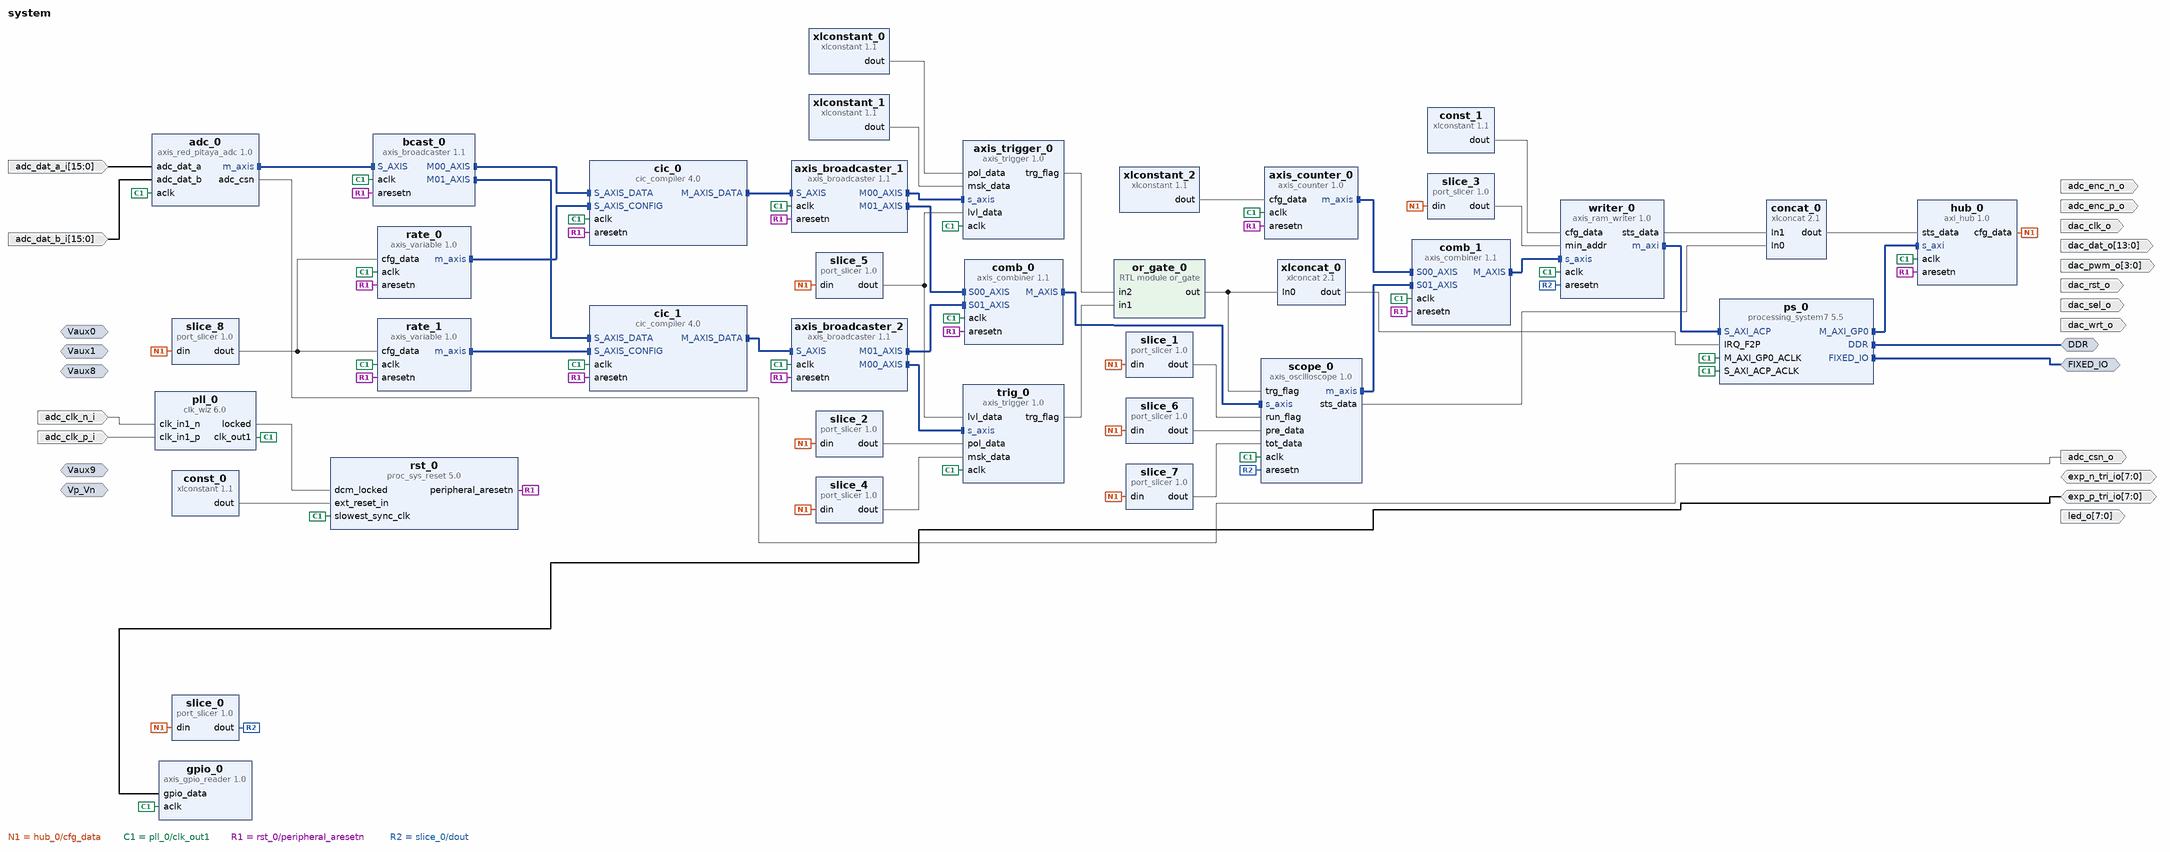
[diagram p0: block diagram of the top level]
# Vivado block design system, xc7z010clg400-1, Vivado 2024.1
create_bd_design system

create_bd_intf_port -mode Slave -vlnv xilinx.com:interface:diff_analog_io_rtl:1.0 Vp_Vn
create_bd_intf_port -mode Slave -vlnv xilinx.com:interface:diff_analog_io_rtl:1.0 Vaux0
create_bd_intf_port -mode Slave -vlnv xilinx.com:interface:diff_analog_io_rtl:1.0 Vaux1
create_bd_intf_port -mode Slave -vlnv xilinx.com:interface:diff_analog_io_rtl:1.0 Vaux9
create_bd_intf_port -mode Slave -vlnv xilinx.com:interface:diff_analog_io_rtl:1.0 Vaux8
create_bd_intf_port -mode Master -vlnv xilinx.com:interface:ddrx_rtl:1.0 DDR
create_bd_intf_port -mode Master -vlnv xilinx.com:display_processing_system7:fixedio_rtl:1.0 FIXED_IO
create_bd_port -dir I -from 15 -to 0 adc_dat_a_i
create_bd_port -dir I -from 15 -to 0 adc_dat_b_i
create_bd_port -dir I adc_clk_p_i
create_bd_port -dir I adc_clk_n_i
create_bd_port -dir O adc_enc_p_o
create_bd_port -dir O adc_enc_n_o
create_bd_port -dir O adc_csn_o
create_bd_port -dir O -from 13 -to 0 dac_dat_o
create_bd_port -dir O dac_clk_o
create_bd_port -dir O dac_rst_o
create_bd_port -dir O dac_sel_o
create_bd_port -dir O dac_wrt_o
create_bd_port -dir O -from 3 -to 0 dac_pwm_o
create_bd_port -dir IO -from 7 -to 0 exp_p_tri_io
create_bd_port -dir IO -from 7 -to 0 exp_n_tri_io
create_bd_port -dir O -from 7 -to 0 led_o

create_bd_cell -type ip -vlnv xilinx.com:ip:clk_wiz:6.0 pll_0
set_property -dict [list \
  CONFIG.CLKOUT1_REQUESTED_OUT_FREQ 125.0 \
  CONFIG.CLKOUT1_USED true \
  CONFIG.PRIMITIVE PLL \
  CONFIG.PRIM_IN_FREQ 125.0 \
  CONFIG.PRIM_SOURCE Differential_clock_capable_pin \
  CONFIG.USE_RESET false \
] [get_bd_cells pll_0]
create_bd_cell -type ip -vlnv xilinx.com:ip:processing_system7:5.5 ps_0
set_property -dict [list \
  CONFIG.PCW_APU_PERIPHERAL_FREQMHZ 666.666666 \
  CONFIG.PCW_ENET0_ENET0_IO {MIO 16 .. 27} \
  CONFIG.PCW_ENET0_GRP_MDIO_ENABLE 1 \
  CONFIG.PCW_ENET0_GRP_MDIO_IO {MIO 52 .. 53} \
  CONFIG.PCW_ENET0_PERIPHERAL_ENABLE 1 \
  CONFIG.PCW_ENET0_RESET_ENABLE 0 \
  CONFIG.PCW_ENET_RESET_ENABLE 1 \
  CONFIG.PCW_ENET_RESET_SELECT {Share reset pin} \
  CONFIG.PCW_FPGA0_PERIPHERAL_FREQMHZ 50 \
  CONFIG.PCW_FPGA1_PERIPHERAL_FREQMHZ 50 \
  CONFIG.PCW_GPIO_EMIO_GPIO_ENABLE 1 \
  CONFIG.PCW_GPIO_EMIO_GPIO_IO 64 \
  CONFIG.PCW_GPIO_MIO_GPIO_ENABLE 1 \
  CONFIG.PCW_GPIO_MIO_GPIO_IO MIO \
  CONFIG.PCW_GPIO_PERIPHERAL_ENABLE 1 \
  CONFIG.PCW_I2C0_GRP_INT_ENABLE 0 \
  CONFIG.PCW_I2C0_I2C0_IO {MIO 50 .. 51} \
  CONFIG.PCW_I2C0_PERIPHERAL_ENABLE 1 \
  CONFIG.PCW_I2C_PERIPHERAL_FREQMHZ 111.111115 \
  CONFIG.PCW_I2C_RESET_ENABLE 1 \
  CONFIG.PCW_I2C_RESET_SELECT {Share reset pin} \
  CONFIG.PCW_IMPORT_BOARD_PRESET cfg/red_pitaya.xml \
  CONFIG.PCW_IRQ_F2P_INTR 1 \
  CONFIG.PCW_PRESET_BANK1_VOLTAGE {LVCMOS 2.5V} \
  CONFIG.PCW_QSPI_PERIPHERAL_ENABLE 0 \
  CONFIG.PCW_SD0_GRP_CD_ENABLE 1 \
  CONFIG.PCW_SD0_GRP_CD_IO {MIO 46} \
  CONFIG.PCW_SD0_GRP_WP_ENABLE 1 \
  CONFIG.PCW_SD0_GRP_WP_IO {MIO 47} \
  CONFIG.PCW_SD0_PERIPHERAL_ENABLE 1 \
  CONFIG.PCW_SD0_SD0_IO {MIO 40 .. 45} \
  CONFIG.PCW_SDIO_PERIPHERAL_FREQMHZ 100 \
  CONFIG.PCW_SPI0_PERIPHERAL_ENABLE 1 \
  CONFIG.PCW_SPI0_SPI0_IO EMIO \
  CONFIG.PCW_SPI1_PERIPHERAL_ENABLE 1 \
  CONFIG.PCW_SPI1_SPI1_IO {MIO 10 .. 15} \
  CONFIG.PCW_UART0_PERIPHERAL_ENABLE 1 \
  CONFIG.PCW_UART0_UART0_IO {MIO 14 .. 15} \
  CONFIG.PCW_UART1_PERIPHERAL_ENABLE 1 \
  CONFIG.PCW_UART1_UART1_IO {MIO 8 .. 9} \
  CONFIG.PCW_UART_PERIPHERAL_FREQMHZ 100 \
  CONFIG.PCW_UIPARAM_DDR_BUS_WIDTH {16 Bit} \
  CONFIG.PCW_UIPARAM_DDR_FREQ_MHZ 533.333333 \
  CONFIG.PCW_UIPARAM_DDR_PARTNO {MT41J256M16 RE-125} \
  CONFIG.PCW_USB0_PERIPHERAL_ENABLE 1 \
  CONFIG.PCW_USB0_RESET_ENABLE 1 \
  CONFIG.PCW_USB0_RESET_IO {MIO 48} \
  CONFIG.PCW_USB0_USB0_IO {MIO 28 .. 39} \
  CONFIG.PCW_USB_RESET_ENABLE 1 \
  CONFIG.PCW_USB_RESET_SELECT {Share reset pin} \
  CONFIG.PCW_USE_DEFAULT_ACP_USER_VAL 1 \
  CONFIG.PCW_USE_FABRIC_INTERRUPT 1 \
  CONFIG.PCW_USE_S_AXI_ACP 1 \
] [get_bd_cells ps_0]
# 429 more settings of ps_0 are not shown: defaults, MIO pin electricals, DDR timing, and values the tool derives
create_bd_cell -type ip -vlnv xilinx.com:ip:xlconstant:1.1 const_0
create_bd_cell -type ip -vlnv xilinx.com:ip:proc_sys_reset:5.0 rst_0
create_bd_cell -type ip -vlnv pavel-demin:user:axis_red_pitaya_adc:1.0 adc_0
set_property -dict {CONFIG.ADC_DATA_WIDTH 14} [get_bd_cells adc_0]
create_bd_cell -type ip -vlnv pavel-demin:user:axis_gpio_reader:1.0 gpio_0
set_property -dict {CONFIG.AXIS_TDATA_WIDTH 8} [get_bd_cells gpio_0]
create_bd_cell -type ip -vlnv pavel-demin:user:axi_hub:1.0 hub_0
set_property -dict {CONFIG.CFG_DATA_WIDTH 192 CONFIG.STS_DATA_WIDTH 64} [get_bd_cells hub_0]
create_bd_cell -type ip -vlnv pavel-demin:user:port_slicer:1.0 slice_0
set_property -dict {CONFIG.DIN_FROM 0 CONFIG.DIN_TO 0 CONFIG.DIN_WIDTH 192} [get_bd_cells slice_0]
create_bd_cell -type ip -vlnv pavel-demin:user:port_slicer:1.0 slice_1
set_property -dict {CONFIG.DIN_FROM 1 CONFIG.DIN_TO 1 CONFIG.DIN_WIDTH 192} [get_bd_cells slice_1]
create_bd_cell -type ip -vlnv pavel-demin:user:port_slicer:1.0 slice_2
set_property -dict {CONFIG.DIN_FROM 16 CONFIG.DIN_TO 16 CONFIG.DIN_WIDTH 192} [get_bd_cells slice_2]
create_bd_cell -type ip -vlnv pavel-demin:user:port_slicer:1.0 slice_3
set_property -dict {CONFIG.DIN_FROM 63 CONFIG.DIN_TO 32 CONFIG.DIN_WIDTH 192} [get_bd_cells slice_3]
create_bd_cell -type ip -vlnv pavel-demin:user:port_slicer:1.0 slice_4
set_property -dict {CONFIG.DIN_FROM 79 CONFIG.DIN_TO 64 CONFIG.DIN_WIDTH 192} [get_bd_cells slice_4]
create_bd_cell -type ip -vlnv pavel-demin:user:port_slicer:1.0 slice_5
set_property -dict {CONFIG.DIN_FROM 95 CONFIG.DIN_TO 80 CONFIG.DIN_WIDTH 192} [get_bd_cells slice_5]
create_bd_cell -type ip -vlnv pavel-demin:user:port_slicer:1.0 slice_6
set_property -dict {CONFIG.DIN_FROM 127 CONFIG.DIN_TO 96 CONFIG.DIN_WIDTH 192} [get_bd_cells slice_6]
create_bd_cell -type ip -vlnv pavel-demin:user:port_slicer:1.0 slice_7
set_property -dict {CONFIG.DIN_FROM 159 CONFIG.DIN_TO 128 CONFIG.DIN_WIDTH 192} [get_bd_cells slice_7]
create_bd_cell -type ip -vlnv pavel-demin:user:port_slicer:1.0 slice_8
set_property -dict {CONFIG.DIN_FROM 175 CONFIG.DIN_TO 160 CONFIG.DIN_WIDTH 192} [get_bd_cells slice_8]
create_bd_cell -type ip -vlnv xilinx.com:ip:axis_broadcaster:1.1 bcast_0
set_property -dict [list \
  CONFIG.M00_TDATA_REMAP {tdata[15:0]} \
  CONFIG.M01_TDATA_REMAP {tdata[31:16]} \
  CONFIG.M_TDATA_NUM_BYTES 2 \
  CONFIG.S_TDATA_NUM_BYTES 4 \
] [get_bd_cells bcast_0]
create_bd_cell -type ip -vlnv pavel-demin:user:axis_variable:1.0 rate_0
set_property -dict {CONFIG.AXIS_TDATA_WIDTH 16} [get_bd_cells rate_0]
create_bd_cell -type ip -vlnv pavel-demin:user:axis_variable:1.0 rate_1
set_property -dict {CONFIG.AXIS_TDATA_WIDTH 16} [get_bd_cells rate_1]
create_bd_cell -type ip -vlnv xilinx.com:ip:cic_compiler:4.0 cic_0
set_property -dict [list \
  CONFIG.Clock_Frequency 125 \
  CONFIG.Filter_Type Decimation \
  CONFIG.Fixed_Or_Initial_Rate 5 \
  CONFIG.HAS_ARESETN true \
  CONFIG.Input_Data_Width 14 \
  CONFIG.Input_Sample_Frequency 125 \
  CONFIG.Maximum_Rate 6250 \
  CONFIG.Minimum_Rate 5 \
  CONFIG.Number_Of_Stages 6 \
  CONFIG.Output_Data_Width 16 \
  CONFIG.Quantization Truncation \
  CONFIG.Sample_Rate_Changes Programmable \
  CONFIG.Use_Xtreme_DSP_Slice false \
] [get_bd_cells cic_0]
create_bd_cell -type ip -vlnv xilinx.com:ip:cic_compiler:4.0 cic_1
set_property -dict [list \
  CONFIG.Clock_Frequency 125 \
  CONFIG.Filter_Type Decimation \
  CONFIG.Fixed_Or_Initial_Rate 5 \
  CONFIG.HAS_ARESETN true \
  CONFIG.Input_Data_Width 14 \
  CONFIG.Input_Sample_Frequency 125 \
  CONFIG.Maximum_Rate 6250 \
  CONFIG.Minimum_Rate 5 \
  CONFIG.Number_Of_Stages 6 \
  CONFIG.Output_Data_Width 16 \
  CONFIG.Quantization Truncation \
  CONFIG.Sample_Rate_Changes Programmable \
  CONFIG.Use_Xtreme_DSP_Slice false \
] [get_bd_cells cic_1]
create_bd_cell -type ip -vlnv xilinx.com:ip:axis_combiner:1.1 comb_0
set_property -dict {CONFIG.NUM_SI 2 CONFIG.TDATA_NUM_BYTES 2} [get_bd_cells comb_0]
create_bd_cell -type ip -vlnv pavel-demin:user:axis_trigger:1.0 trig_0
set_property -dict {CONFIG.AXIS_TDATA_SIGNED TRUE CONFIG.AXIS_TDATA_WIDTH 16} [get_bd_cells trig_0]
create_bd_cell -type ip -vlnv pavel-demin:user:axis_oscilloscope:1.0 scope_0
set_property -dict {CONFIG.AXIS_TDATA_WIDTH 32 CONFIG.CNTR_WIDTH 23} [get_bd_cells scope_0]
create_bd_cell -type ip -vlnv xilinx.com:ip:xlconstant:1.1 const_1
set_property -dict {CONFIG.CONST_VAL 262143 CONFIG.CONST_WIDTH 18} [get_bd_cells const_1]
create_bd_cell -type ip -vlnv pavel-demin:user:axis_ram_writer:1.0 writer_0
set_property -dict [list \
  CONFIG.ADDR_WIDTH 18 \
  CONFIG.AXIS_TDATA_WIDTH 32 \
  CONFIG.AXI_ID_WIDTH 3 \
  CONFIG.FIFO_WRITE_DEPTH 1024 \
] [get_bd_cells writer_0]
create_bd_cell -type ip -vlnv xilinx.com:ip:xlconcat:2.1 concat_0
set_property -dict {CONFIG.IN0_WIDTH 32 CONFIG.IN1_WIDTH 32 CONFIG.NUM_PORTS 2} [get_bd_cells concat_0]
create_bd_cell -type ip -vlnv pavel-demin:user:axis_trigger:1.0 axis_trigger_0
set_property -dict {CONFIG.AXIS_TDATA_SIGNED TRUE CONFIG.AXIS_TDATA_WIDTH 16} [get_bd_cells axis_trigger_0]
create_bd_cell -type ip -vlnv xilinx.com:ip:xlconstant:1.1 xlconstant_0
create_bd_cell -type ip -vlnv xilinx.com:ip:xlconstant:1.1 xlconstant_1
set_property -dict {CONFIG.CONST_VAL 0xFFFFFFFF CONFIG.CONST_WIDTH 32} [get_bd_cells xlconstant_1]
create_bd_cell -type ip -vlnv xilinx.com:ip:axis_broadcaster:1.1 axis_broadcaster_1
create_bd_cell -type ip -vlnv xilinx.com:ip:axis_broadcaster:1.1 axis_broadcaster_2
create_bd_cell -type module -reference or_gate or_gate_0
create_bd_cell -type ip -vlnv xilinx.com:ip:axis_combiner:1.1 comb_1
set_property -dict {CONFIG.NUM_SI 2 CONFIG.TDATA_NUM_BYTES 2} [get_bd_cells comb_1]
create_bd_cell -type ip -vlnv xilinx.com:ip:xlconcat:2.1 xlconcat_0
create_bd_cell -type ip -vlnv pavel-demin:user:axis_counter:1.0 axis_counter_0
create_bd_cell -type ip -vlnv xilinx.com:ip:xlconstant:1.1 xlconstant_2
set_property -dict {CONFIG.CONST_VAL 0 CONFIG.CONST_WIDTH 32} [get_bd_cells xlconstant_2]

# ---- connections ----

connect_bd_intf_net [get_bd_intf_pins bcast_0/S_AXIS] [get_bd_intf_pins adc_0/m_axis]
connect_bd_intf_net [get_bd_intf_pins axis_broadcaster_1/M00_AXIS] [get_bd_intf_pins axis_trigger_0/s_axis]
connect_bd_intf_net [get_bd_intf_pins axis_broadcaster_1/M01_AXIS] [get_bd_intf_pins comb_0/S00_AXIS]
connect_bd_intf_net [get_bd_intf_pins axis_broadcaster_2/M00_AXIS] [get_bd_intf_pins trig_0/s_axis]
connect_bd_intf_net [get_bd_intf_pins axis_broadcaster_2/M01_AXIS] [get_bd_intf_pins comb_0/S01_AXIS]
connect_bd_intf_net [get_bd_intf_pins axis_counter_0/m_axis] [get_bd_intf_pins comb_1/S00_AXIS]
connect_bd_intf_net [get_bd_intf_pins cic_0/S_AXIS_DATA] [get_bd_intf_pins bcast_0/M00_AXIS]
connect_bd_intf_net [get_bd_intf_pins cic_1/S_AXIS_DATA] [get_bd_intf_pins bcast_0/M01_AXIS]
connect_bd_intf_net [get_bd_intf_pins cic_0/M_AXIS_DATA] [get_bd_intf_pins axis_broadcaster_1/S_AXIS]
connect_bd_intf_net [get_bd_intf_pins cic_1/M_AXIS_DATA] [get_bd_intf_pins axis_broadcaster_2/S_AXIS]
connect_bd_intf_net [get_bd_intf_pins comb_0/M_AXIS] [get_bd_intf_pins scope_0/s_axis]
connect_bd_intf_net [get_bd_intf_pins comb_1/M_AXIS] [get_bd_intf_pins writer_0/s_axis]
connect_bd_intf_net [get_bd_intf_ports DDR] [get_bd_intf_pins ps_0/DDR]
connect_bd_intf_net [get_bd_intf_ports FIXED_IO] [get_bd_intf_pins ps_0/FIXED_IO]
connect_bd_intf_net [get_bd_intf_pins hub_0/s_axi] [get_bd_intf_pins ps_0/M_AXI_GP0]
connect_bd_intf_net [get_bd_intf_pins cic_0/S_AXIS_CONFIG] [get_bd_intf_pins rate_0/m_axis]
connect_bd_intf_net [get_bd_intf_pins cic_1/S_AXIS_CONFIG] [get_bd_intf_pins rate_1/m_axis]
connect_bd_intf_net [get_bd_intf_pins scope_0/m_axis] [get_bd_intf_pins comb_1/S01_AXIS]
connect_bd_intf_net [get_bd_intf_pins writer_0/m_axi] [get_bd_intf_pins ps_0/S_AXI_ACP]
connect_bd_net [get_bd_ports exp_p_tri_io] [get_bd_pins gpio_0/gpio_data]
connect_bd_net [get_bd_pins adc_0/adc_csn] [get_bd_ports adc_csn_o]
connect_bd_net [get_bd_ports adc_clk_n_i] [get_bd_pins pll_0/clk_in1_n]
connect_bd_net [get_bd_ports adc_clk_p_i] [get_bd_pins pll_0/clk_in1_p]
connect_bd_net [get_bd_ports adc_dat_a_i] [get_bd_pins adc_0/adc_dat_a]
connect_bd_net [get_bd_ports adc_dat_b_i] [get_bd_pins adc_0/adc_dat_b]
connect_bd_net [get_bd_pins axis_trigger_0/trg_flag] [get_bd_pins or_gate_0/in2]
connect_bd_net [get_bd_pins concat_0/dout] [get_bd_pins hub_0/sts_data]
connect_bd_net [get_bd_pins const_0/dout] [get_bd_pins rst_0/ext_reset_in]
connect_bd_net [get_bd_pins const_1/dout] [get_bd_pins writer_0/cfg_data]
connect_bd_net [get_bd_pins hub_0/cfg_data] \
  [get_bd_pins slice_0/din] [get_bd_pins slice_1/din] [get_bd_pins slice_2/din] [get_bd_pins slice_3/din] \
  [get_bd_pins slice_4/din] [get_bd_pins slice_5/din] [get_bd_pins slice_6/din] [get_bd_pins slice_7/din] \
  [get_bd_pins slice_8/din]
connect_bd_net [get_bd_pins or_gate_0/out] [get_bd_pins scope_0/trg_flag] [get_bd_pins xlconcat_0/In0]
connect_bd_net [get_bd_pins pll_0/clk_out1] \
  [get_bd_pins ps_0/M_AXI_GP0_ACLK] [get_bd_pins ps_0/S_AXI_ACP_ACLK] [get_bd_pins rst_0/slowest_sync_clk] \
  [get_bd_pins adc_0/aclk] [get_bd_pins gpio_0/aclk] [get_bd_pins hub_0/aclk] [get_bd_pins bcast_0/aclk] \
  [get_bd_pins rate_0/aclk] [get_bd_pins rate_1/aclk] [get_bd_pins cic_0/aclk] [get_bd_pins cic_1/aclk] \
  [get_bd_pins comb_0/aclk] [get_bd_pins trig_0/aclk] [get_bd_pins scope_0/aclk] [get_bd_pins writer_0/aclk] \
  [get_bd_pins axis_trigger_0/aclk] [get_bd_pins axis_broadcaster_1/aclk] [get_bd_pins axis_broadcaster_2/aclk] \
  [get_bd_pins comb_1/aclk] [get_bd_pins axis_counter_0/aclk]
connect_bd_net [get_bd_pins pll_0/locked] [get_bd_pins rst_0/dcm_locked]
connect_bd_net [get_bd_pins rst_0/peripheral_aresetn] \
  [get_bd_pins hub_0/aresetn] [get_bd_pins bcast_0/aresetn] [get_bd_pins rate_0/aresetn] [get_bd_pins rate_1/aresetn] \
  [get_bd_pins cic_0/aresetn] [get_bd_pins cic_1/aresetn] [get_bd_pins comb_0/aresetn] \
  [get_bd_pins axis_broadcaster_2/aresetn] [get_bd_pins axis_broadcaster_1/aresetn] [get_bd_pins comb_1/aresetn] \
  [get_bd_pins axis_counter_0/aresetn]
connect_bd_net [get_bd_pins scope_0/sts_data] [get_bd_pins concat_0/In0]
connect_bd_net [get_bd_pins slice_0/dout] [get_bd_pins scope_0/aresetn] [get_bd_pins writer_0/aresetn]
connect_bd_net [get_bd_pins slice_1/dout] [get_bd_pins scope_0/run_flag]
connect_bd_net [get_bd_pins slice_2/dout] [get_bd_pins trig_0/pol_data]
connect_bd_net [get_bd_pins slice_3/dout] [get_bd_pins writer_0/min_addr]
connect_bd_net [get_bd_pins slice_4/dout] [get_bd_pins trig_0/msk_data]
connect_bd_net [get_bd_pins slice_5/dout] [get_bd_pins trig_0/lvl_data] [get_bd_pins axis_trigger_0/lvl_data]
connect_bd_net [get_bd_pins slice_6/dout] [get_bd_pins scope_0/pre_data]
connect_bd_net [get_bd_pins slice_7/dout] [get_bd_pins scope_0/tot_data]
connect_bd_net [get_bd_pins slice_8/dout] [get_bd_pins rate_0/cfg_data] [get_bd_pins rate_1/cfg_data]
connect_bd_net [get_bd_pins trig_0/trg_flag] [get_bd_pins or_gate_0/in1]
connect_bd_net [get_bd_pins writer_0/sts_data] [get_bd_pins concat_0/In1]
connect_bd_net [get_bd_pins xlconcat_0/dout] [get_bd_pins ps_0/IRQ_F2P]
connect_bd_net [get_bd_pins xlconstant_0/dout] [get_bd_pins axis_trigger_0/pol_data]
connect_bd_net [get_bd_pins xlconstant_1/dout] [get_bd_pins axis_trigger_0/msk_data]
connect_bd_net [get_bd_pins xlconstant_2/dout] [get_bd_pins axis_counter_0/cfg_data]

validate_bd_design
save_bd_design
